# Altium schematic sheet lab2_arhipov_buck.SchDoc: =title_line_1 + title_line_2
size 594 x 420 mm; SheetNumber: n
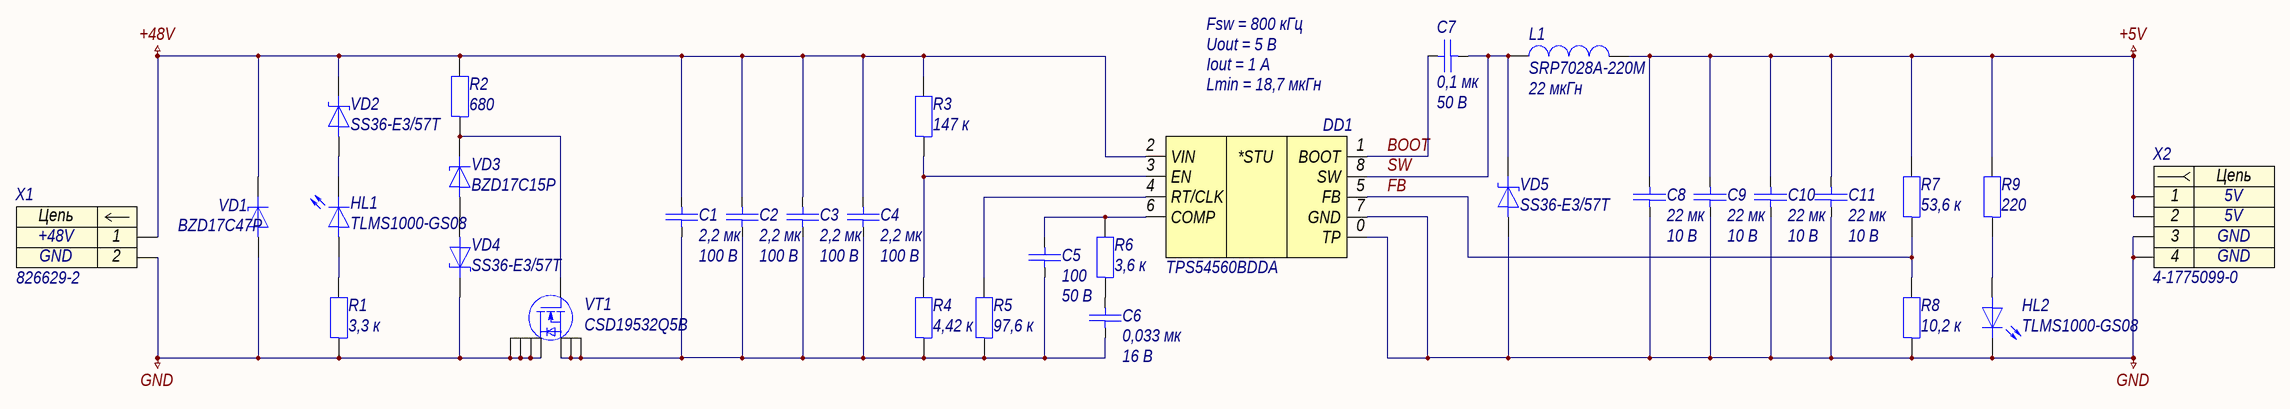
[diagram p0: lab2_arhipov_buck.SchDoc]

## Parts
C1  2,2 мк  Напряжение: 100 В  [C1206]
C2  2,2 мк  Напряжение: 100 В  [C1206]
C3  2,2 мк  Напряжение: 100 В  [C1206]
C4  2,2 мк  Напряжение: 100 В  [C1206]
C5  100  Напряжение: 50 В  [C0603]
C6  0,033 мк  Напряжение: 16 В  [C0603]
C7  0,1 мк  Напряжение: 50 В  [C0603]
C8  22 мк  Напряжение: 10 В  [C0603]
C9  22 мк  Напряжение: 10 В  [C0603]
C10  22 мк  Напряжение: 10 В  [C0603]
C11  22 мк  Напряжение: 10 В  [C0603]
DD1  TPS54560BDDA  [HSOP-8]
HL1  TLMS1000-GS08  [HL0603]
HL2  TLMS1000-GS08  [HL0603]
L1  SRP7028A-220M  Индуктивность: 22 мкГн  [SRP-2-670X660X280]
R1  3,3 к  [R0603]
R2  680  [R0603]
R3  147 к  [R0603]
R4  4,42 к  [R0603]
R5  97,6 к  [R0603]
R6  3,6 к  [R0603]
R7  53,6 к  [R0603]
R8  10,2 к  [R0603]
R9  220  [R0603]
VD1  BZD17C47P  [DO-219AB]
VD2  SS36-E3/57T  [DO-214AB]
VD3  BZD17C15P  [DO-219AB]
VD4  SS36-E3/57T  [DO-214AB]
VD5  SS36-E3/57T  [DO-214AB]
VT1  CSD19532Q5B  [SON-8]
X1  826629-2  [TE_826629-2]
X2  4-1775099-0  [4-1775099-0]

## Nets
+5V: C8.1 C9.1 C10.1 C11.1 L1.2 R7.2 R9.2 X2.1 X2.2
+48V: C1.1 C2.1 C3.1 C4.1 DD1.2(VIN) R2.2 R3.2 VD1.1 VD2.1 X1.1
GND: C8.2 C9.2 C10.2 C11.2 DD1.0(TP) DD1.7(GND) HL2.1 R1.1 R8.1 VD1.2 VD4.1 VD5.2 VT1.D X1.2 X2.3 X2.4
BOOT: C7.1 DD1.1(BOOT)
FB: DD1.5(FB) R7.1 R8.2
SW: C7.2 DD1.8(SW) L1.1 VD5.1
NetC1_2: C1.2 C2.2 C3.2 C4.2 C5.2 C6.2 R4.1 R5.1 VT1.S
NetC5_1: C5.1 DD1.6(COMP) R6.2
NetC6_1: C6.1 R6.1
NetDD1_3: DD1.3(EN) R3.1 R4.2
NetDD1_4: DD1.4(RT/CLK) R5.2
NetHL1_1: HL1.1 VD2.2
NetHL1_2: HL1.2 R1.2
NetHL2_2: HL2.2 R9.1
NetR2_1: R2.1 VD3.1 VT1.G
NetVD3_2: VD3.2 VD4.2

## Notes on the sheet
- Fsw = 800 кГц
- Uout = 5 В
- Iout = 1 А
- Lmin = 18,7 мкГн
- Перв. примен.
- Справ. №
- Подп. и дата
- Инв. № дубл.
- Нормоконтроль:
- Взам. инв. №
- Изм.
- Лист
- № докум.
- Подп.
- Дата
- Лит.
- Масса
- Масштаб
- Т.контр.
- Пров.
- Разраб.
- Листов
- Разработал:
- Инв. № подл.
- Н.контр.
- Утв.
- Копировал
- Формат
- А2
- (in symbol 826629-2) Цепь
- (in symbol dd0009) *STU
- (in symbol x0004) Цепь

## Library data of the parts
C1-C4 = c0078: =Описание; ID: c0078; Фамилия: Ларионов; Описание: Конденсатор чип 1206 2,2 мкФ 100 В ±10 %; Наименование: CC1206KKX7R0BB225; Производитель: YAGEO Corp.; Отклонение: ±10 %; Рабочие температуры: от –55 °С до +125 °С; Температурный коэффициент емкости: X7R; Корпус: 1206; Номинал: 2,2 мк; Номинальное напряжение: 100 В; HelpURL: https://www.yageo.com/upload/media/product/productsearch/datasheet/mlcc/UPY-NP0X7R_MV_100-to-630V_22.pdf
C5 = c0044: =Описание; ID: c0044; Фамилия: Архипов; Описание: Конденсатор чип 0603 100 пФ 50 В ±5 %; Наименование: GRM1885C1H101JA01D; Производитель: Murata Manufacturing Co., Ltd.; Отклонение: ±5 %; Рабочие температуры: от -55 °С до +125 °С; Корпус: 0603; Номинал: 100; Номинальное напряжение: 50 В; HelpURL: https://www.murata.com/en-eu/products/productdetail?partno=GRM1885C1H101JA01%23
C6 = c0027: =Описание; ID: c0027; Фамилия: Ларионов; Описание: Конденсатор чип 0603 33 нФ 16 В ±5 %; Наименование: CC0603JPX7R7BB333; Производитель: YAGEO Corp.; Отклонение: ±5 %; Рабочие температуры: от –55 °С до +125 °С; Температурный коэффициент емкости: X7R; Корпус: 0603; Номинал: 0,033 мк; Номинальное напряжение: 16 В; HelpURL: https://www.yageo.com/upload/media/product/productsearch/datasheet/mlcc/UPY-GPHC_X7R_6.3V-to-50V_20.pdf
C7 = c0018: =Описание; ID: c0018; Фамилия: Ларионов; Описание: Конденсатор чип 0603 0,1 мкФ 50 В ±5 %; Наименование: CC0603JRX7R9BB104; Производитель: YAGEO Corp.; Отклонение: ±5 %; Рабочие температуры: от -55 °С до +125 °С; Корпус: 0603; Номинал: 0,1 мк; Номинальное напряжение: 50 В; HelpURL: https://www.yageo.com/upload/media/product/products/datasheet/mlcc/UPY-GPHC_X7R_6.3V-to-50V_20.pdf
C8-C11 = c0101: =Описание; ID: c0101; Фамилия: Чернов; Описание: Конденсатор чип 0603 22 мкФ 10 В ±20 %; Наименование: CC0603MPX5R6BB226; Производитель: YAGEO Corp.; Отклонение: ±20 %; Рабочие температуры: от –55 °С до +85 °С; Температурный коэффициент емкости: X5R; Корпус: 0603; Номинал: 22 мк; Номинальное напряжение: 10 В; HelpURL: https://www.yageo.com/upload/media/product/productsearch/datasheet/mlcc/UPY-GPHC_X5R_4V-to-50V_26.pdf
DD1 = dd0009: =Описание; ID: dd0009; Фамилия: Архипов; Описание: Понижающий преобразователь напряжения 60 В и 5 А; Производитель: Texas Instruments; Входное напряжение: от 4,5 В до 60 В; Выходное напряжение: от 1 В до 58,8 В; Коммутируемый ток: от 0 А до 5 А; Частота переключения: от 100 кГц до 2,5 МГц; Рабочие температуры: от –40 °С до +150 °С; Наименование: TPS54560BDDA; Корпус: HSOP-8; HelpURL: https://www.ti.com/product/TPS54560B
HL1 HL2 = hl0001: =Описание; ID: hl0001; Фамилия: Ларионов; Описание: Светодиод чип 0603 красный; Производитель: Vishay Intertechnology, Inc.; Цвет: Red; Номинальная сила света: 4 мкд; Номинальная длина волны: 628 нм; Номинальный прямой ток: 15 мА; Номинальное падение напряжения: 1,8 В; Рассеиваемая мощность: 40 мВт; Рабочие температуры: от -40 °С до +100 °С; Корпус: 0603; Наименование: TLMS1000-GS08; HelpURL: https://www.vishay.com/leds/list/product-83172/
L1 = l0006: =Описание; ID: l0006; Фамилия: Ларионов; Описание: Катушка индуктивности 22 мкГн ±20 %; Производитель: Bourns, Inc.; Отклонение: ±20 %; Номинальное активное сопротивление: 165 мОм; Максимальное активное сопротивление: 190 мОм; Резонансная частота: 10 МГц; Номинальный ток (при нагреве на 20 °С/40 °С): 2 А; Ток насыщения: 3,5 А; Рабочее напряжение: не указано; Рабочие температуры: от –55 °С до +150 °С; Корпус: 6,7 x 6,6 x 2,8; Наименование: SRP7028A-220M; Номинал: 22 мкГн; HelpURL: https://www.bourns.com/products/magnetic-products/power-inductors-aec-q200-compliant/product/SRP7028A
R1 = r0025: =Описание; ID: r0025; Фамилия: Паньков; Описание: Резистор чип 0603 3,3 кОм ±1 % 0,1 Вт; Наименование: RC0603FR-073K3L; Производитель: YAGEO Corp.; Отклонение: ±1 %; Номинальное напряжение: 75 В; Рабочие температуры: от -55 °С до +155 °С; Номинальный ток: 1 А; Корпус: 0603; Номинал: 3,3 к; HelpURL: https://www.yageo.com/upload/media/product/productsearch/datasheet/rchip/PYu-RC_Group_51_RoHS_L_11.pdf
R2 = r0028: =Описание; ID: r0028; Фамилия: Архипов; Описание: Резистор чип 0603 680 Ом ±1 % 0,1 Вт; Наименование: RC0603JR-07680RL; Производитель: YAGEO Corp.; Отклонение: ±1 %; Номинальное напряжение: 75 В; Рабочие температуры: от –55 °С до +155 °С; Номинальный ток: 1 А; Корпус: 0603; Номинал: 680; HelpURL: https://www.yageo.com/upload/media/product/productsearch/datasheet/rchip/PYu-RC_Group_51_RoHS_L_11.pdf
R3 = r0102: =Описание; ID: r0102; Фамилия: Жернаков; Описание: Резистор чип 0603 147 кОм ±1 % 0,1 Вт; Наименование: RC0603FR-07147KL; Производитель: YAGEO Corp.; Отклонение: ±1 %; Номинальное напряжение: 75 В; Рабочие температуры: от –55 °С до +155 °С; Номинальный ток: 1 А; Корпус: 0603; Номинал: 147 к; HelpURL: https://www.yageo.com/upload/media/product/productsearch/datasheet/rchip/PYu-RC_Group_51_RoHS_L_11.pdf
R4 = r0015: =Описание; ID: r0015; Фамилия: Жернаков; Описание: Резистор чип 0603 4,42 кОм ±1 % 0,1 Вт; Наименование: RC0603FR-074K42L; Производитель: YAGEO Corp.; Отклонение: ±1 %; Номинальное напряжение: 75 В; Рабочие температуры: от -55 °С до +155 °С; Номинальный ток: 1 А; Корпус: 0603; Номинал: 4,42 к; HelpURL: https://www.yageo.com/upload/media/product/productsearch/datasheet/rchip/PYu-RC_Group_51_RoHS_L_11.pdf
R5 = r0029: =Описание; ID: r0029; Фамилия: Водорезов; Описание: Резистор чип 0603 97,6 кОм ±1 % 0,1 Вт; Наименование: RC0603FR-0797K6L; Производитель: YAGEO Corp.; Отклонение: ±1 %; Номинальное напряжение: 75 В; Рабочие температуры: от -55 °С до +155 °С; Номинальный ток: 1 А; Корпус: 0603; Номинал: 97,6 к; HelpURL: https://www.yageo.com/upload/media/product/productsearch/datasheet/rchip/PYu-RC_Group_51_RoHS_L_11.pdf
R6 = r0026: =Описание; ID: r0026; Фамилия: Паньков; Описание: Резистор чип 0603 3,6 кОм ±1 % 0,1 Вт; Наименование: RC0603FR-073K6L; Производитель: YAGEO Corp.; Отклонение: ±1 %; Номинальное напряжение: 75 В; Рабочие температуры: от -55 °С до +155 °С; Номинальный ток: 1 А; Корпус: 0603; Номинал: 3,6 к; HelpURL: https://www.yageo.com/upload/media/product/productsearch/datasheet/rchip/PYu-RC_Group_51_RoHS_L_11.pdf
R7 = r0017: =Описание; ID: r0017; Фамилия: Жернаков; Описание: Резистор чип 0603 53,6 кОм ±0,1 % 0,1 Вт; Наименование: RC0603BR-0753K6L; Производитель: YAGEO Corp.; Отклонение: ±0,1 %; Номинальное напряжение: 75 В; Рабочие температуры: от -55 °С до +155 °С; Номинальный ток: 1 А; Корпус: 0603; Номинал: 53,6 к; HelpURL: https://www.yageo.com/upload/media/product/productsearch/datasheet/rchip/PYu-RC_Group_51_RoHS_L_11.pdf
R8 = r0014: =Описание; ID: r0014; Фамилия: Жернаков; Описание: Резистор чип 0603 10,2 кОм ±1 % 0,1 Вт; Наименование: RC0603FR-0710K2L; Производитель: YAGEO Corp.; Отклонение: ±1 %; Номинальное напряжение: 75 В; Рабочие температуры: от -55 °С до +155 °С; Номинальный ток: 1 А; Корпус: 0603; Номинал: 10,2 к; HelpURL: https://www.yageo.com/upload/media/product/productsearch/datasheet/rchip/PYu-RC_Group_51_RoHS_L_11.pdf
R9 = r0009: =Описание; ID: r0009; Фамилия: Ларионов; Описание: Резистор чип 0603 220 Ом ±1 % 0,1 Вт; Наименование: RC0603FR-07220RL; Производитель: YAGEO Corp.; Отклонение: ±1 %; Номинальное напряжение: 75 В; Рабочие температуры: от -55 °С до +155 °С; Номинальный ток: 1 А; Корпус: 0603; Номинал: 220; HelpURL: https://www.yageo.com/upload/media/product/productsearch/datasheet/rchip/PYu-RC_Group_51_RoHS_L_11.pdf
VD1 = vd0028: =Описание; ID: vd0028; Фамилия: Паньков; Описание: Стабилитрон 47 В; Производитель: Vishay Intertechnology, Inc.; Номинальное напряжение стабилизации: 47 В; Разброс напряжения стабилизации: 44,0...50,0 В; Номинальный ток стабилизации: 10 мА; Рабочие температуры: от –55 °С до +150 °С; Наименование: BZD17C47P; Корпус: DO-219AB; HelpURL: https://www.vishay.com/product?docid=85161
VD2 VD4 VD5 = vd0004: =Описание; ID: vd0004; Фамилия: Жернаков; Описание: Диод Шоттки 60 В 3 А; Производитель: Vishay Intertechnology, Inc.; Пиковое прямое напряжение: 0,75 В; Импульсное обратное напряжение: 60 В; Макс допустимый средний прямой ток: 3 А; Рабочие температуры: от –55 °С до +150 °С; Наименование: SS36-E3/57T; Корпус: DO-214AB; HelpURL: https://www.vishay.com/product?docid=88751
VD3 = vd0016: =Описание; ID: vd0016; Фамилия: Жернаков; Описание: Стабилитрон 15 В; Производитель: Vishay Intertechnology, Inc.; Номинальное напряжение стабилизации: 15 В; Разброс напряжения стабилизации: 13,8...15,6 В; Номинальный ток стабилизации: 50 мА; Рабочие температуры: от –55 °С до +150 °С; Наименование: BZD17C15P; Корпус: DO-219AB; HelpURL: https://www.vishay.com/product?docid=85161
VT1 = vt0001: =Описание; ID: vt0001; Фамилия: Жернаков; Описание: Транзистор полевой N-канальный 100 В 17 А; Производитель: Texas Instruments; Напряжение затвор — исток: ±20 В; Напряжение сток — исток: 100 В; Ток стока: 17 А; Сопротивление сток — исток: 0,0057 Ом; Рабочие температуры: от –55 °С до +150 °С; Наименование: CSD19532Q5B; Корпус: SON-8; HelpURL: https://www.ti.com/product/CSD19532Q5B
X1 = 826629-2: Number_of_Positions: 2; Centerline_Pitch: 2.54 mm[.1 in]; MF: TE Connectivity; Product_Type: Connector; Contact_1: +48V; Contact_2: GND; Package: None; Value: *; TE_purchase_URL: https://www.te.com/usa-en/product-826629-2.html?te_bu=Cor&te_type=disp&te_campaign=seda_glo_cor-seda-global-disp-prtnr-fy19-seda-model-bom-cta_sma-317_1&elqCampaignId=32493; EU_RoHS_Compliance: Compliant; Availability: Unavailable; SnapEDA_Link: https://www.snapeda.com/parts/826629-2/TE%20Connectivity%20AMP%20Connectors/view-part/494607/?ref=snap; Price: None; MP: 826629-2
X2 = x0004: =Описание; Contact_1: 5V; Contact_3: GND; ID: x0004; Фамилия: Ларионов; Описание: ATX Power 4 pin гнездо прямой; Производитель: TE Connectivity; Contact_2: 5V; Contact_4: GND; Наименование: 4-1775099-0; HelpURL: https://www.te.com/usa-en/product-4-1775099-0.html